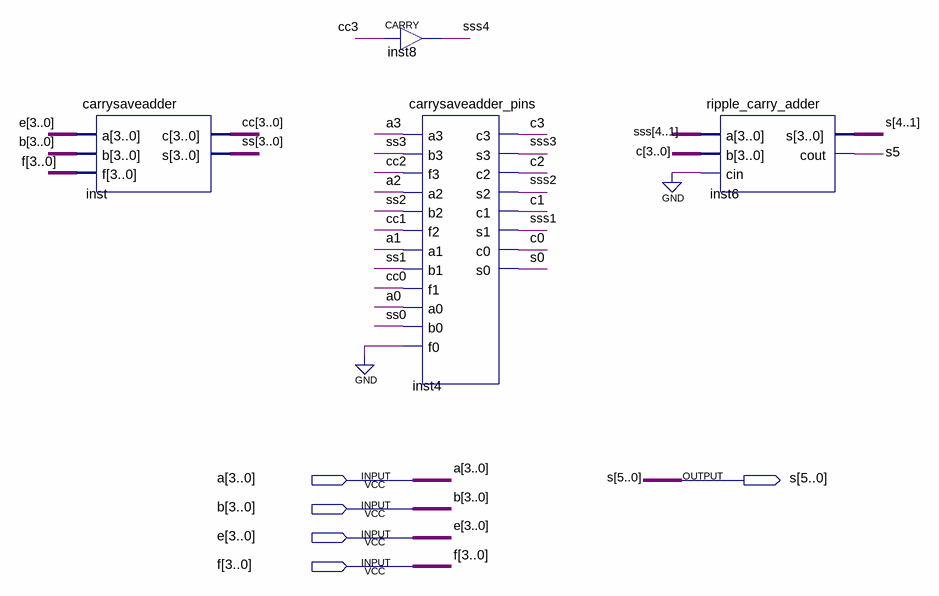
[diagram p0: schematic sheet]
// Quartus schematic carrysave_ripplecarry_adder.bdf as structural Verilog: 4 symbols, 5 pins
module carrysave_ripplecarry_adder (
  input  [3:0] a,
  input  [3:0] b,
  input  [3:0] e,
  input  [3:0] f,
  output [5:0] s
);

  wire [3:0] c, cc, ss;
  wire [4:1] sss;

  carrysaveadder inst (.a(e), .b(b), .f(f), .c(cc), .s(ss));
  CARRY inst8 (.IN(cc[3]), .OUT(sss[4]));
  carrysaveadder_pins inst4 (
    .a3(a[3]), .b3(ss[3]), .f3(cc[2]), .a2(a[2]), .b2(ss[2]), .f2(cc[1]), .a1(a[1]), .b1(ss[1]), .f1(cc[0]),
    .a0(a[0]), .b0(ss[0]), .f0(1'b0), .c3(c[3]), .s3(sss[3]), .c2(c[2]), .s2(sss[2]), .c1(c[1]), .s1(sss[1]),
    .c0(c[0]), .s0(s[0]));
  ripple_carry_adder inst6 (.a(sss), .b(c), .cin(1'b0), .s(s[4:1]), .cout(s[5]));
endmodule
